# EAGLE design BatMeas5.3 JST (EAGLE 6.4)
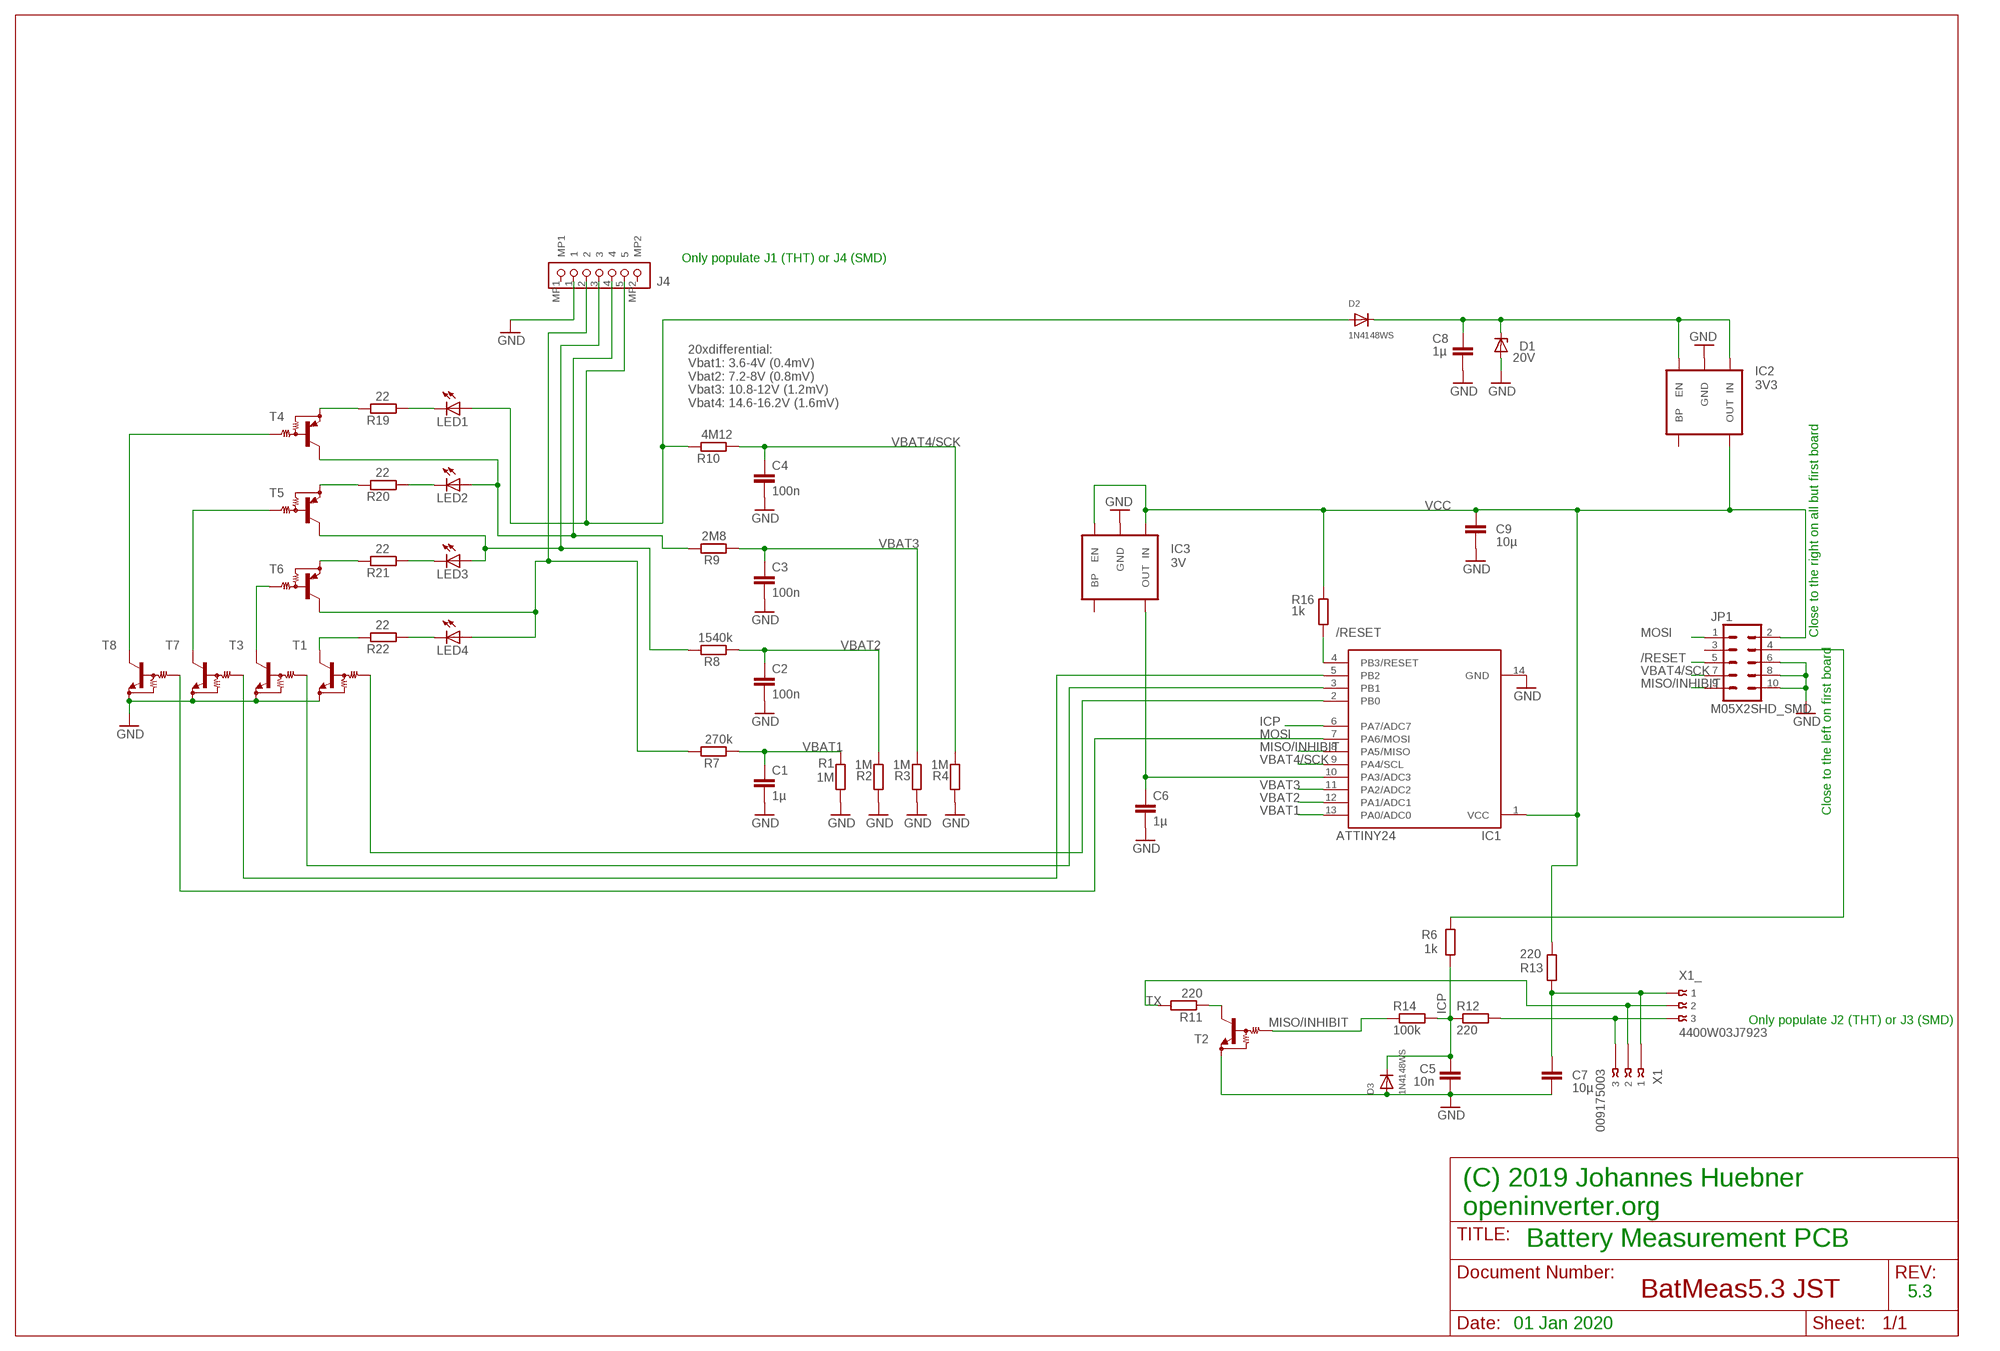
[diagram p0: schematic, sheet 1]

## Parts
C1  1µ  C-EUC0603  [C0603]
C2  100n  C-EUC0603  [C0603]
C3  100n  C-EUC0603  [C0603]
C4  100n  C-EUC0603  [C0603]
C5  10n  C-EUC0603  [C0603]
C6  1µ  C-EUC0603  [C0603]
C7  10µ  C-EUC0805  [C0805]
C8  1µ  C-EUC0805  [C0805]
C9  10µ  C-EUC0805  [C0805]
D1  20V  ZENER-DIODESMB  [SMB]
D2  1N4148WS  DIODESOD-323F  [SOD-323F]
D3  1N4148WS  DIODESOD-323F  [SOD-323F]
IC1  ATTINY24  [SO014]
IC2  3V3  V_REG_LDOSMD  [SOT23-5]
IC3  3V  V_REG_LDOSMD  [SOT23-5]
J4  BM05B-PASS-1-TFT_(LF)(SN)SMD  [BM05BPASS1TFTLFSN]
JP1  M05X2SHD_SMD  [2X5-SHROUDED_SMD]
LED1  150060GS75000  LEDCHIPLED_0805  [CHIPLED_0805]
LED2  150060GS75000  LEDCHIPLED_0805  [CHIPLED_0805]
LED3  150060GS75000  LEDCHIPLED_0805  [CHIPLED_0805]
LED4  150060GS75000  LEDCHIPLED_0805  [CHIPLED_0805]
R1  1M  R-EU_R0603  [R0603]
R2  1M  R-EU_R0603  [R0603]
R3  1M  R-EU_R0603  [R0603]
R4  1M  R-EU_R0603  [R0603]
R6  1k  R-EU_R0603  [R0603]
R7  270k  R-EU_R0603  [R0603]
R8  1540k  R-EU_R0603  [R0603]
R9  2M8  R-EU_R0603  [R0603]
R10  4M12  R-EU_R0603  [R0603]
R11  220  R-EU_R0603  [R0603]
R12  220  R-EU_R0603  [R0603]
R13  220  R-EU_R0603  [R0603]
R14  100k  R-EU_R0603  [R0603]
R16  1k  R-EU_R0603  [R0603]
R19  22  R-EU_R0805  [R0805]
R20  22  R-EU_R0805  [R0805]
R21  22  R-EU_R0805  [R0805]
R22  22  R-EU_R0805  [R0805]
T1  MMUN2233  MUN2211T1-NPN_DRIVER-SC59-BEC  [SC59-BEC]
T2  MMUN2233  MUN2211T1-NPN_DRIVER-SC59-BEC  [SC59-BEC]
T3  MMUN2233  MUN2211T1-NPN_DRIVER-SC59-BEC  [SC59-BEC]
T4  MMUN2111LT1G  MUN2111T1-PNP_DRIVER-SC59-BEC  [SC59-BEC]
T5  MMUN2111LT1G  MUN2111T1-PNP_DRIVER-SC59-BEC  [SC59-BEC]
T6  MMUN2111LT1G  MUN2111T1-PNP_DRIVER-SC59-BEC  [SC59-BEC]
T7  MMUN2233  MUN2211T1-NPN_DRIVER-SC59-BEC  [SC59-BEC]
T8  MMUN2233  MUN2211T1-NPN_DRIVER-SC59-BEC  [SC59-BEC]
X1  009175003  [009175003]
X1_  4400W03J7923  [4400WXXJ7923]

## Nets
/RESET: IC1.4(PB3/RESET) JP1.5 R16.2
GND: C1.2 C2.2 C3.2 C4.2 C5.2 C6.2 C7.2 C8.2 C9.2 D1.A D3.A IC1.14(GND) IC2.2(GND) IC3.2(GND) J4.1 JP1.6 JP1.8 JP1.10 R1.2 R2.2 R3.2 R4.2 T1.E T2.E T3.E T7.E T8.E
ICP: C5.1 D3.C IC1.6(PA7/ADC7) R6.1 R12.1 R14.2
MISO/INHIBIT: IC1.8(PA5/MISO) JP1.9 R14.1 T2.B
MOSI: IC1.7(PA6/MOSI) JP1.1 T8.B
N$1: T3.C T6.B
N$2: C6.1 IC1.10(PA3/ADC3) IC3.5(OUT)
N$3: IC1.2(PB0) T1.B
N$4: IC1.3(PB1) T3.B
N$5: R19.2 T4.E
N$6: LED1.C R19.1
N$7: JP1.4 R6.2
N$10: IC1.5(PB2) T7.B
N$11: R20.2 T5.E
N$12: C7.1 R13.2 X1.1@1 X1_.P$1
N$13: LED2.C R20.1
N$14: R11.1 T2.C
N$17: D2.A J4.5 LED1.A R10.2
N$18: LED3.C R21.1
N$19: LED4.C R22.1
N$20: R21.2 T6.E
N$21: R22.2 T1.C
N$22: R12.2 X1.3@2 X1_.P$3
N$23: J4.4 LED2.A R9.2 T4.C
N$24: J4.3 LED3.A R8.2 T5.C
N$25: J4.2 LED4.A R7.2 T6.C
N$30: T5.B T7.C
N$31: T4.B T8.C
TX: R11.2 X1.2@1 X1_.P$2
VBAT: C8.1 D1.C D2.C IC2.1(IN) IC2.3(EN)
VBAT1: C1.1 IC1.13(PA0/ADC0) R1.1 R7.1
VBAT2: C2.1 IC1.12(PA1/ADC1) R2.1 R8.1
VBAT3: C3.1 IC1.11(PA2/ADC2) R3.1 R9.1
VBAT4/SCK: C4.1 IC1.9(PA4/SCL) JP1.7 R4.1 R10.1
VCC: C9.1 IC1.1(VCC) IC2.5(OUT) IC3.1(IN) IC3.3(EN) JP1.2 R13.1 R16.1
Unconnected: IC2.4(BP) IC3.4(BP) J4.MP1 J4.MP2 JP1.3 X1.1 X1.2 X1.3

## Notes on the sheet
- Only populate J1 (THT) or J4 (SMD)
- 20xdifferential:
  Vbat1: 3.6-4V (0.4mV)
  Vbat2: 7.2-8V (0.8mV)
  Vbat3: 10.8-12V (1.2mV)
  Vbat4: 14.6-16.2V (1.6mV)
- Close to the right on all but first board
- Close to the left on first board
- Only populate J2 (THT) or J3 (SMD)
- (C) 2019 Johannes Huebner
  openinverter.org
- Battery Measurement PCB
- 5.3
- 01 Jan 2020

## Library data of the parts
C1-C9 = rcl:C-EU: CAPACITOR, European symbol
D1 = diode:ZENER-DIODE: Z-Diode
D2 D3 = adafruit:DIODE: Diode SMADIODE - SMA Surface Mount Package 20V 1A Schottky Diode Digikey: 641-1014-6-ND DO-1N4148 - Through Hole Small Current Diode SOD-123 20V 1 A (.5mV Vf) Schottky Diode - Digikey: MBRX120TPMSCT-ND SOD-323 10V 570mA (.38mV Vf, 3ns) Schottky Diode - Digikey: ZLLS410CT-ND SOD-523 30V 30mA Schottky Diode (RB751S-40TE61) - Digikey: RB751S-40TE61CT-ND SOT23-R/W - SOT23 Package (R = Solder Paste/Reflow Ovens, W = Hand-Soldering) BAT54Film 40V 300mA - Digikey: 497-7162-1-ND
IC1 = sparkfun:ATTINY24
IC2 IC3 = SparkFun-PowerIC:V_REG_LDO: Voltage Regulator LDO Standard 150mA LDO voltage regulator in SOT-23 layout. Micrel part MIC5205. BP (by-pass) pin is used to lower output noise with 470pF cap.
J4 = BM03B-PASS-1-TFT_(LF)(SN):BM05B-PASS-1-TFT_(LF)(SN): Conn Shrouded Header HDR 5 POS 2mm Solder ST SMD T/R Source: Datasheet <http://www.jst-mfg.com/product/pdf/eng/ePA-F.pdf>
JP1 = SparkFun-Connectors:M05X2: Header 5x2 Standard 10-pin dual row 0.1" header. Commonly used with AVR-ISP. Use with Spark Fun Electronics SKU: PRT-00778
LED1-LED4 = led:LED: LED OSRAM: - CHIPLED LG R971, LG N971, LY N971, LG Q971, LY Q971, LO R971, LY R971 LH N974, LH R974 LS Q976, LO Q976, LY Q976 LO Q996 - Hyper CHIPLED LW Q18S LB Q993, LB Q99A, LB R99A - SideLED LS A670, LO A670, LY A670, LG A670, LP A670 LB A673, LV A673, LT A673, LW A673 LH A674 LY A675 LS A676, LA A676, LO A676, LY A676, LW A676 LS A679, LY A679, LG A679 - Hyper Micro SIDELED® LS Y876, LA Y876, LO Y876, LY Y876 LT Y87S - SmartLED LW L88C, LW L88S LB L89C, LB L89S, LG L890 LS L89K, LO L89K, LY L89K LS L896, LA L896, LO L896, LY L896 - TOPLED LS T670, LO T670, LY T670, LG T670, LP T670 LSG T670, LSP T670, LSY T670, LOP T670, LYG T670 LG T671, LOG T671, LSG T671 LB T673, LV T673, LT T673, LW T673 LH T674 LS T676, LA T676, LO T676, LY T676, LB T676, LH T676, LSB T676, LW T676 LB T67C, LV T67C, LT T67C, LS T67K, LO T67K, LY T67K, LW E67C LS E67B, LA E67B, LO E67B, LY E67B, LB E67C, LV E67C, LT E67C LW T67C LS T679, LY T679, LG T679 LS T770, LO T770, LY T770, LG T770, LP T770 LB T773, LV T773, LT T773, LW T773 LH T774 LS E675, LA E675, LY E675, LS T675 LS T776, LA T776, LO T776, LY T776, LB T776 LHGB T686 LT T68C, LB T68C - Hyper Mini TOPLED® LB M676 - Mini TOPLED Santana® LG M470 LS M47K, LO M47K, LY M47K Source: http://www.osram.convergy.de LUXEON: - LUMILED® LXK2-PW12-R00, LXK2-PW12-S00, LXK2-PW14-U00, LXK2-PW14-V00 LXK2-PM12-R00, LXK2-PM12-S00, LXK2-PM14-U00 LXK2-PE12-Q00, LXK2-PE12-R00, LXK2-PE12-S00, LXK2-PE14-T00, LXK2-PE14-U00 LXK2-PB12-K00, LXK2-PB12-L00, LXK2-PB12-M00, LXK2-PB14-N00, LXK2-PB14-P00, LXK2-PB14-Q00 LXK2-PR12-L00, LXK2-PR12-M00, LXK2-PR14-Q00, LXK2-PR14-R00 LXK2-PD12-Q00, LXK2-PD12-R00, LXK2-PD12-S00 LXK2-PH12-R00, LXK2-PH12-S00 LXK2-PL12-P00, LXK2-PL12-Q00, LXK2-PL12-R00 Source: www.luxeon.com KINGBRIGHT: KA-3528ASYC Source: www.kingbright.com
R1-R4 R6-R14 R16 R19-R22 = rcl:R-EU_: RESISTOR, European symbol
T1-T3 T7 T8 = transistor:*-NPN_DRIVER-: NPN Bias Resistor Transistor
T4-T6 = transistor:*-PNP_DRIVER-: PNP Bias Resistor Transistor
X1 = con-avx:009175003: Wire to Board IDC Connector 3 WAY Source: http://www.avx.com/docs/Catalogs/9175.pdf; MPN: 009175003001006; OC_FARNELL: 1387485; OC_NEWARK: 40M7661
X1_ = con-avx:4400W03J7923

## Board
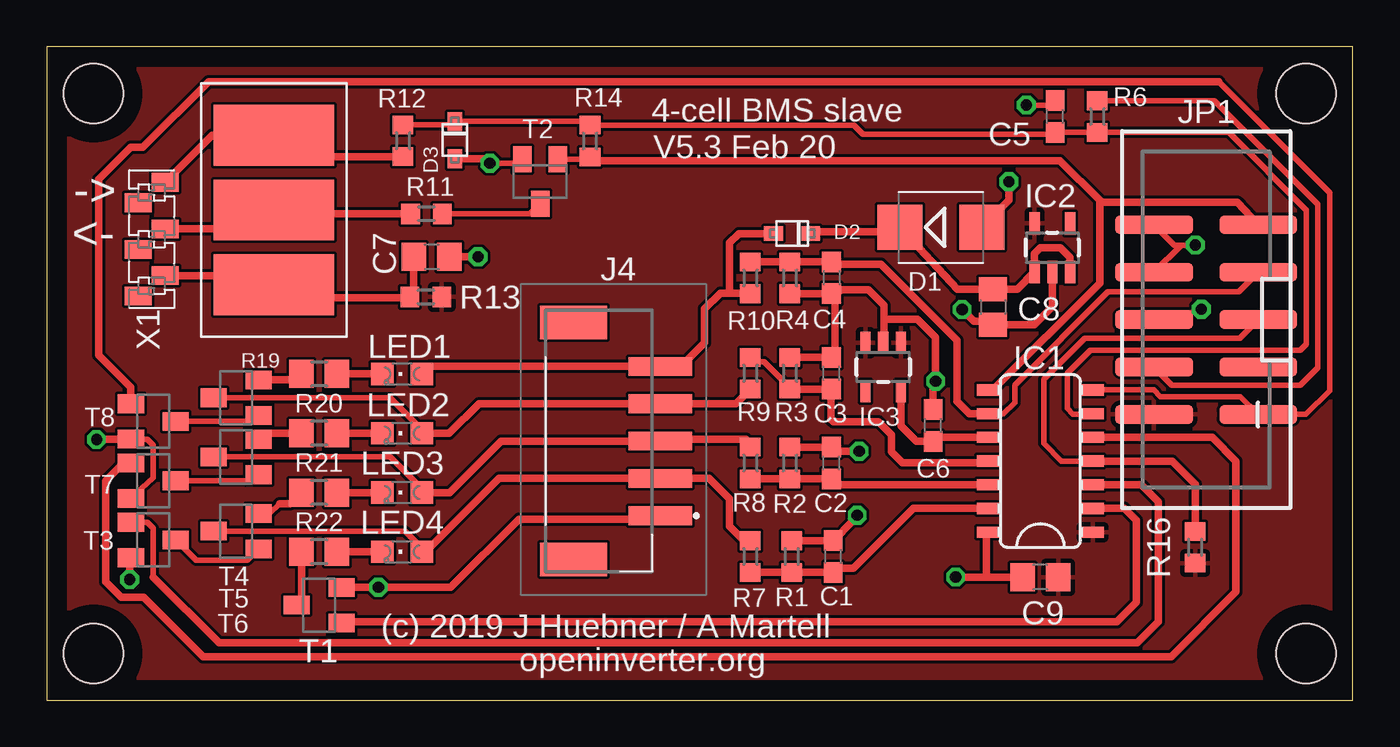
[diagram p1: board, top side]
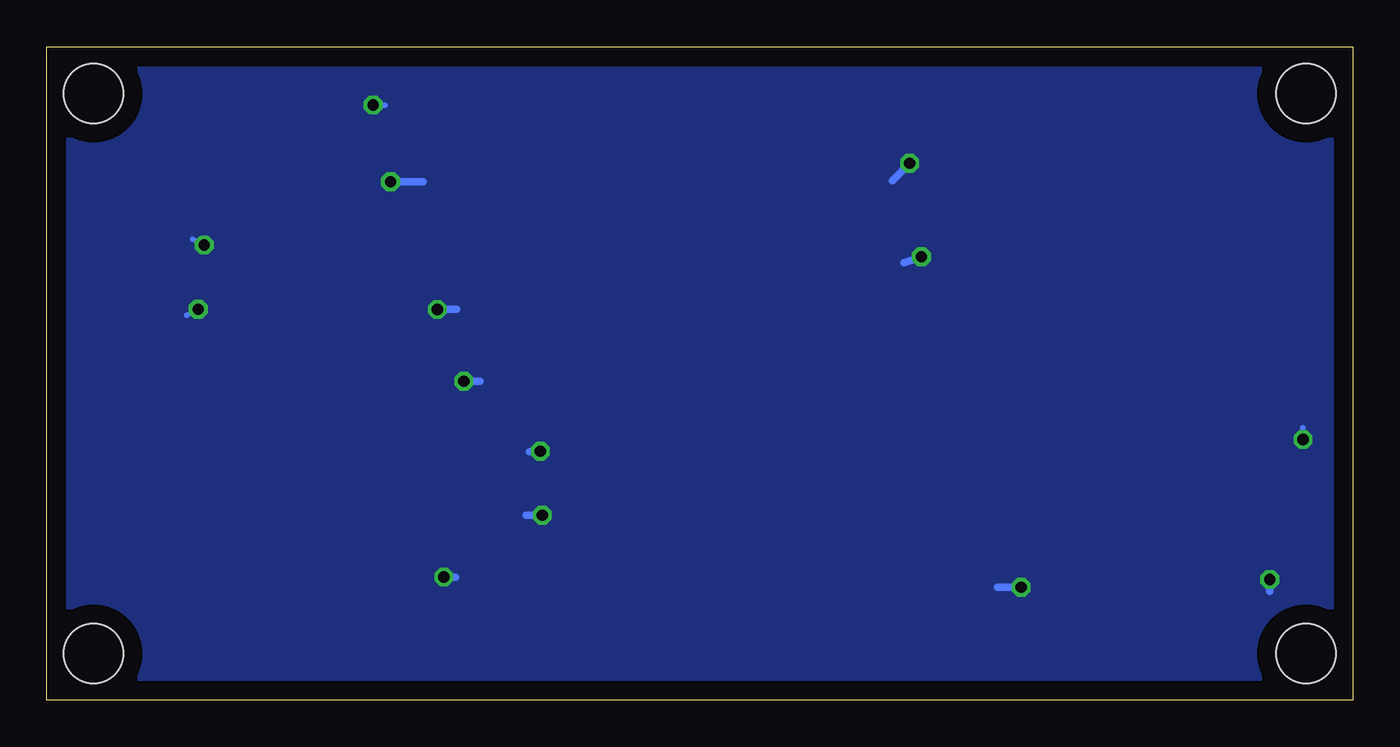
[diagram p2: board, bottom side, seen from below]

Size 70 x 35 mm. Coordinates in mm from the lower left corner, seen from the top.
Outline: 0,0 70,0 70,35 0,35 0,0
Copper layers (1*16): Top 0.035mm / dielectric 1.5mm / Bottom 0.035mm
Design rules "default *": minimum track width 10mil, minimum drill 0.4mm, track to track 6mil, track to pad 6mil, pad to pad 6mil, via to via 6mil, smd to smd 6mil, copper to edge 40mil, drill to drill 8mil, minimum pad ring 10mil, minimum via ring 8mil, stop-mask expansion 4mil, vias tented up to drill 0mil, thermal gap 10mil
Holes 3.2 mm at 2.5,32.5 2.5,2.5 67.5,2.5 67.5,32.5

### Footprints (pad centres in the part's own frame; a part is rotated, then mirrored left to right if it is on the bottom)
C0603 = smd 1.1 x 1: 1 -0.85,0; 2 0.85,0
C0805 = smd 1.3 x 1.5: 1 -0.95,0; 2 0.95,0
SMB = smd 2.4 x 2.4: A 2.2,0; C -2.2,0
SOD-323F = smd 1 x 0.8: A -1,0; C 1,0
SO014 = smd 0.6 x 1.2: 1 -3.175,-2.8; 2 -1.905,-2.8; 3 -0.635,-2.8; 4 0.635,-2.8; 5 1.905,-2.8; 6 3.175,-2.8; 7 4.445,-2.8; 8 4.445,2.8; 9 3.175,2.8; 10 1.905,2.8; 11 0.635,2.8; 12 -0.635,2.8; 13 -1.905,2.8; 14 -3.175,2.8
SOT23-5 = smd 0.55 x 1.2: 1 -0.95,-1.3; 2 0,-1.3; 3 0.95,-1.3; 4 0.95,1.3; 5 -0.95,1.3
BM05BPASS1TFTLFSN = smd 1 x 3.4: 1 2,3.075; 2 0,3.075; 3 -2,3.075; 4 -4,3.075; 5 -6,3.075 | smd 1.8 x 3.6: MP1 -8.35,-1.575; MP2 4.35,-1.575
2X5-SHROUDED_SMD = smd 4.15 x 1: 1 -2.794,5.08; 2 2.794,5.08; 3 -2.794,2.54; 4 2.794,2.54; 5 -2.794,0; 6 2.794,0; 7 -2.794,-2.54; 8 2.794,-2.54; 9 -2.794,-5.08; 10 2.794,-5.08
CHIPLED_0805 = smd 1.2 x 1.2: A 0,-1.05; C 0,1.05
R0603 = smd 1 x 1.1: 1 -0.85,0; 2 0.85,0
R0805 = smd 1.3 x 1.5: 1 -0.95,0; 2 0.95,0
SC59-BEC = smd 1 x 1.4: B -0.95,-1.2; C 0,1.2; E 0.95,-1.2
009175003 = smd 1 x 1.45: 1 -3.05,0.725; 1@1 -1.95,-0.725; 2 -0.55,0.725; 2@1 0.55,-0.725; 3 1.95,0.725; 3@2 3.05,-0.725
4400WXXJ7923 = smd 3.251 x 6.452: P$1 -4,0; P$2 0,0; P$3 4,0

### Placement (x,y rotation side)
C1  42.16,7.68 90 top
C2  42.06,12.7 90 top
C3  42.06,17.5 90 top
C4  42.06,22.61 270 top
C5  54.04,31.25 90 top
C6  47.51,14.71 90 top
C7  20.62,23.75 0 top
C8  50.72,21.05 270 top
C9  53.26,6.58 180 top
D1  47.93,25.32 0 top
D2  39.95,24.99 0 top
D3  21.88,30 90 top
IC1  53.26,12.16 90 top
IC2  53.89,24.23 0 top
IC3  44.83,17.84 180 top
J4  29.81,11.88 270 top
JP1  62.14,20.38 180 top
LED1  19.05,17.46 90 top
LED2  19.05,14.29 90 top
LED3  19.05,11.12 90 top
LED4  19.05,7.94 90 top
R1  39.93,7.68 90 top
R2  39.83,12.7 90 top
R3  39.83,17.5 90 top
R4  39.83,22.61 270 top
R6  56.3,31.25 90 top
R7  37.72,7.68 90 top
R8  37.72,12.7 90 top
R9  37.72,17.5 270 top
R10  37.72,22.61 270 top
R11  20.36,26.05 180 top
R12  19.1,29.96 270 top
R13  20.32,21.59 180 top
R14  29.12,29.95 90 top
R16  61.55,8.19 90 top
R19  14.61,17.46 180 top
R20  14.61,14.29 180 top
R21  14.61,11.12 180 top
R22  14.61,7.94 180 top
T1  14.61,5.08 90 top
T2  26.45,27.78 180 top
T3  5.71,8.57 270 top
T4  10.16,16.2 90 top
T5  10.16,13.02 90 top
T6  10.16,9.04 90 top
T7  5.71,11.75 270 top
T8  5.71,14.93 270 top
X1  5.62,24.69 90 top
X1_  12.19,26.25 90 top

### Tracks (layer width: path | path; a pad name or v marks a point on that pad's centre or on a via)
/RESET
  Top 0.305: JP1.5 63.93,19.38 55.62,19.38 53.44,17.19 53.44,13.75 54.39,12.8 IC1.4
  Top 0.406: R16.2 61.56,9.05 61.56,11.56 60.33,12.8 IC1.4
GND  (via drill 0.6)
  Top 0.305: T7.E 5.71,11.9 5.71,13.65 5.39,13.97 T8.E 4.29,13.65 | JP1.8 60.8,24.38 | JP1.10 60.43,24.38 60.8,24.38 | 60.8,24.38 v61.56,24.38 | JP1.6 59.91,20.31 v61.88,20.94 | C5.2 53.96,31.88 v52.5,31.88 | T2.E 25.27,28.75 v23.75,28.75
  Top 0.406: T1.E v17.78,6.04 21.66,6.04 25.31,9.69 33.95,9.69 J4.1 | R1.2 C1.2 43.21,9.59 v43.44,9.9 | R2.2 C2.2 42.27,13.33 v43.54,13.33 | R3.2 C3.2 42.24,18.86 42.24,21.66 C4.2 | R4.2 C4.2 | C6.2 47.51,16.95 v47.64,17.08 47.64,19.43 46.66,20.4 44.86,20.4 | IC3.2 44.86,19.7 44.86,20.4 | 44.86,20.4 44.86,21.14 44.03,21.96 42.66,21.96 C4.2 | D1.A 51.57,26.76 v51.57,27.77 | T3.E 4.45,7.46 v4.45,6.45 | IC2.2 53.89,21.05 52.94,20.11 C8.2 50.54,20.29 49.7,20.29 v49.06,20.92 | C9.2 50.36,6.58 | 50.36,6.58 v48.72,6.58 | IC1.14 50.36,8.99 50.36,6.59 50.36,6.58 | v2.67,13.96 2.69,13.97 T8.E | D3.A 23.75,29 v23.75,28.75 | C7.2 v23.12,23.75
  Bottom 0.305: v2.67,13.96 2.67,14.59 | v61.56,24.38 62.19,24.69 | v61.88,20.94 62.5,20.62 | v52.5,31.88 51.88,31.88
  Bottom 0.406: v17.78,6.04 19.05,6.04 | 44.31,9.9 v43.44,9.9 | v43.54,13.33 43.26,13.3 44.13,13.3 | 46.77,17.08 v47.64,17.08 | v51.57,27.77 49.84,27.77 | v4.45,6.45 4.45,5.82 | v49.06,20.92 48.03,20.92 | v48.72,6.58 48.08,6.58 | 24.69,27.81 v23.75,28.75 | v23.12,23.75 24.06,23.44
  pour Bottom: 1.2,33.8 68.8,33.8 68.8,1.2 1.2,1.2
ICP
  Top 0.305: IC1.6 56.03,15.31 55,15.31 54.69,15.62 54.69,17.5 55.94,18.75 67.19,18.75 67.5,19.06 67.5,26.25 63.34,30.41 R6.1 C5.1 53.82,30.31 43.75,30.31 43.27,30.8 R14.2 28.91,31 D3.C 21.68,30.81 R12.1
MISO/INHIBIT
  Top 0.305: R14.1 29,28.98 T2.B
  Top 0.406: 56.43,26.67 56.43,22.32 50.72,16.61 IC1.8 | 56.43,26.67 56.43,26.77 54.3,28.9 29.32,28.9 R14.1 | 56.43,26.67 63.81,26.67 JP1.9
MOSI
  Top 0.305: IC1.7 59.33,16.61 59.69,16.25 63.98,16.25 JP1.1 67.48,15.3 68.75,16.56 68.75,27.19 62.81,33.12
  Top 0.406: 56.16,16.51 IC1.7 | T8.B 4.51,16.76 2.8,18.48 2.8,27.9 4.5,29.6 5.15,29.6 8.68,33.12 62.81,33.12
N$1
  Top 0.305: T6.B 10.74,7.47 8.02,7.47 T3.C
N$2
  Top 0.406: IC1.10 47.72,14.07 C6.1 46.61,13.86 45.78,14.68 IC3.5
N$3
  Top 0.406: IC1.2 57.76,10.26 58.4,9.62 58.4,5.23 57.35,4.18 15.85,4.18 T1.B
N$4
  Top 0.305: 5.71,6.58 5.71,9.21 5.4,9.53 T3.B
  Top 0.406: IC1.3 58.66,11.53 59.56,10.62 59.56,4.18 58.44,3.06 9.24,3.06 5.71,6.58
N$5
  Top 0.305: 13.34,17.14 R19.2
  Top 0.406: T4.E 13.34,17.14
N$6
  Top 0.406: R19.1 LED1.C
N$7
  Top 0.305: JP1.4 60.31,16.88 67.19,16.88 68.12,17.81 68.12,26.56 62.58,32.1 R6.2
N$10
  Top 0.406: IC1.5 62.47,14.07 63.74,12.8 63.74,5.79 60.27,2.32 8.38,2.32 5.2,5.5 4,5.5 3.17,6.33 3.17,11.75 4.12,12.7 T7.B
N$11
  Top 0.305: T5.E 11.68,14.29
  Top 0.406: 11.68,14.29 R20.2
N$12
  Top 0.305: R13.2 19.68,21.8
  Top 0.406: R13.2 19.44,21.56 12.19,21.56 X1_.P$1 12.19,22.74 X1.1@1 | 19.68,21.8 C7.1
N$13
  Top 0.406: R20.1 LED2.C
N$14
  Top 0.305: T2.C 25.92,26.05 R11.1
N$17
  Top 0.406: 34.13,18.01 J4.5 20.51,17.88 LED1.A | 34.13,18.01 35.27,19.14 35.27,20.97 36.1,21.8 36.6,21.8 | 36.6,21.8 37.66,21.8 R10.2 | D2.A 37.09,24.99 36.6,24.5 36.6,21.8 | 34.13,18.01 33.87,17.74
N$18
  Top 0.406: R21.1 LED3.C
N$19
  Top 0.406: R22.1 LED4.C
N$20
  Top 0.305: T6.E 11.96,9.99 12.48,10.52
  Top 0.406: 12.48,10.52 13.05,10.52 R21.2
N$21
  Top 0.305: T1.C 13.65,5.23
  Top 0.406: 13.65,5.23 R22.2
N$22
  Top 0.406: R12.2 12.19,29.11 X1_.P$3 8.86,30.25 X1.3@2
N$23
  Top 0.305: T4.C 18.41,16.2 20.1,14.51 LED2.A
  Top 0.406: LED2.A 21.58,14.29 23.16,15.88 J4.4 | 34.11,15.9 J4.4 | J4.4 36.94,15.88 R9.2
N$24
  Top 0.305: T5.C 18.41,13.02 20.1,11.34 LED3.A
  Top 0.406: 20.1,11.34 20.32,11.12 21.59,11.12 24.35,13.88 J4.3 | R8.2 37.49,13.97 34.23,13.97 J4.3 | 34.04,13.97 J4.3
N$25
  Top 0.305: T6.C 19.21,9.04 20.1,8.16 LED4.A 20.32,7.94
  Top 0.406: 20.32,7.94 24.25,11.88 J4.2 | 34.11,11.9 J4.2 | J4.2 35.5,11.88 36.6,10.78 36.6,9.3 37.37,8.54 R7.2
N$30
  Top 0.305: T5.B 11.04,11.75 T7.C
N$31
  Top 0.305: 6.88,14.99 7.59,14.93 10.79,14.93 11.12,15.24 T4.B
  Top 0.406: T8.C 6.88,14.99
TX
  Top 0.406: R11.2 12.19,26.05 X1_.P$2 12.19,26.88 12.81,26.88 12.81,25.24 X1.2@1
VBAT
  Top 0.254: 54.33,24.23 54.39,24.16
  Top 0.406: D2.C 41.05,25.09 45.72,25.09 D1.C 48.8,22 C8.1 52.02,22 IC2.1 52.94,23.91 53.26,24.23 54.33,24.23 | IC2.3 54.84,23.71 54.39,24.16
VBAT1
  Top 0.406: R7.1 R1.1 C1.1 42.37,7.05 43.23,7.05 46.44,10.26 IC1.13
VBAT2
  Top 0.406: R8.1 R2.1 C2.1 42.36,11.54 42.34,11.53 IC1.12
VBAT3
  Top 0.305: R9.1 37.95,18.12 38.44,18.12 39.83,16.73 R3.1
  Top 0.406: R3.1 C3.1 42.04,16.68 42.04,15.03 42.16,14.9 44.56,14.9 45.26,14.2 45.26,13.3 45.86,12.7 50.36,12.7 IC1.11
VBAT4/SCK
  Top 0.305: JP1.7 63.89,21.88 56.88,21.88 51.88,16.88 51.88,15.94 51.28,15.34 IC1.9
  Top 0.406: R10.1 R4.1 C4.1 42.57,23.35 44.71,23.35 48.78,19.28 48.78,16.01 49.45,15.34 IC1.9
VCC
  pour Top: 1.2,33.8 68.8,33.8 68.8,1.2 1.2,1.2

### Text on the board
tNames: 4-cell BMS slave | V5.3 Feb 20 | -> | <- | (c) 2019 J Huebner / A Martell | openinverter.org